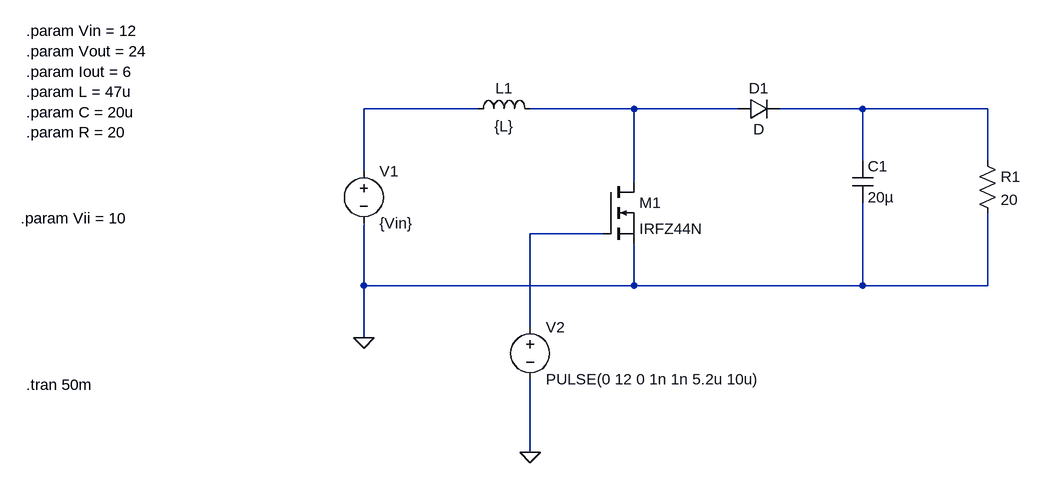
[diagram p0: schematic BoostConverter.asc]
BoostConverter.asc, the LTspice schematic file:
Version 4.1
SHEET 1 1336 680
WIRE 496 96 320 96
WIRE 736 96 576 96
WIRE 896 96 736 96
WIRE 1088 96 960 96
WIRE 1280 96 1088 96
WIRE 1088 176 1088 96
WIRE 1280 176 1280 96
WIRE 320 192 320 96
WIRE 736 208 736 96
WIRE 688 288 576 288
WIRE 320 368 320 272
WIRE 736 368 736 304
WIRE 736 368 320 368
WIRE 1088 368 1088 240
WIRE 1088 368 736 368
WIRE 1280 368 1280 256
WIRE 1280 368 1088 368
WIRE 576 432 576 288
WIRE 320 448 320 368
WIRE 576 624 576 512
FLAG 320 448 0
FLAG 576 624 0
SYMBOL voltage 320 176 R0
WINDOW 123 0 0 Left 0
WINDOW 39 0 0 Left 0
SYMATTR InstName V1
SYMATTR Value {Vin}
SYMBOL ind 480 112 R270
WINDOW 0 32 56 VTop 2
WINDOW 3 5 56 VBottom 2
SYMATTR InstName L1
SYMATTR Value {L}
SYMBOL nmos 688 208 R0
SYMATTR InstName M1
SYMATTR Value IRFZ44N
SYMBOL voltage 576 416 R0
WINDOW 123 0 0 Left 0
WINDOW 39 0 0 Left 0
SYMATTR InstName V2
SYMATTR Value PULSE(0 12 0 1n 1n 5.2u 10u)
SYMBOL diode 896 112 R270
WINDOW 0 32 32 VTop 2
WINDOW 3 0 32 VBottom 2
SYMATTR InstName D1
SYMBOL cap 1072 176 R0
SYMATTR InstName C1
SYMATTR Value 20µ
SYMBOL res 1264 160 R0
SYMATTR InstName R1
SYMATTR Value 20
TEXT -200 -24 Left 2 !.param Vin = 12\n.param Vout = 24\n.param Iout = 6\n.param L = 47u\n.param C = 20u\n.param R = 20
TEXT -200 520 Left 2 !.tran 50m
TEXT -208 264 Left 2 !.param Vii = 10

The netlist it stands for:
* BoostConverter.asc
V1 N001 0 {Vin}
L1 N001 N002 {L}
M1 N002 N004 0 0 IRFZ44N
V2 N004 0 PULSE(0 12 0 1n 1n 5.2u 10u)
D1 N002 N003 D
C1 N003 0 20µ
R1 N003 0 20
.model D D
.lib standard.dio
.model NMOS NMOS
.model PMOS PMOS
.lib standard.mos
.param Vin = 12
.param Vout = 24
.param Iout = 6
.param L = 47u
.param C = 20u
.param R = 20
.tran 50m
.param Vii = 10
.backanno
.end